# EAGLE design current_sense (EAGLE 8.7.1)
AUTHOR: Pat Pannuto; REV: v4; TITLE: Current Sense
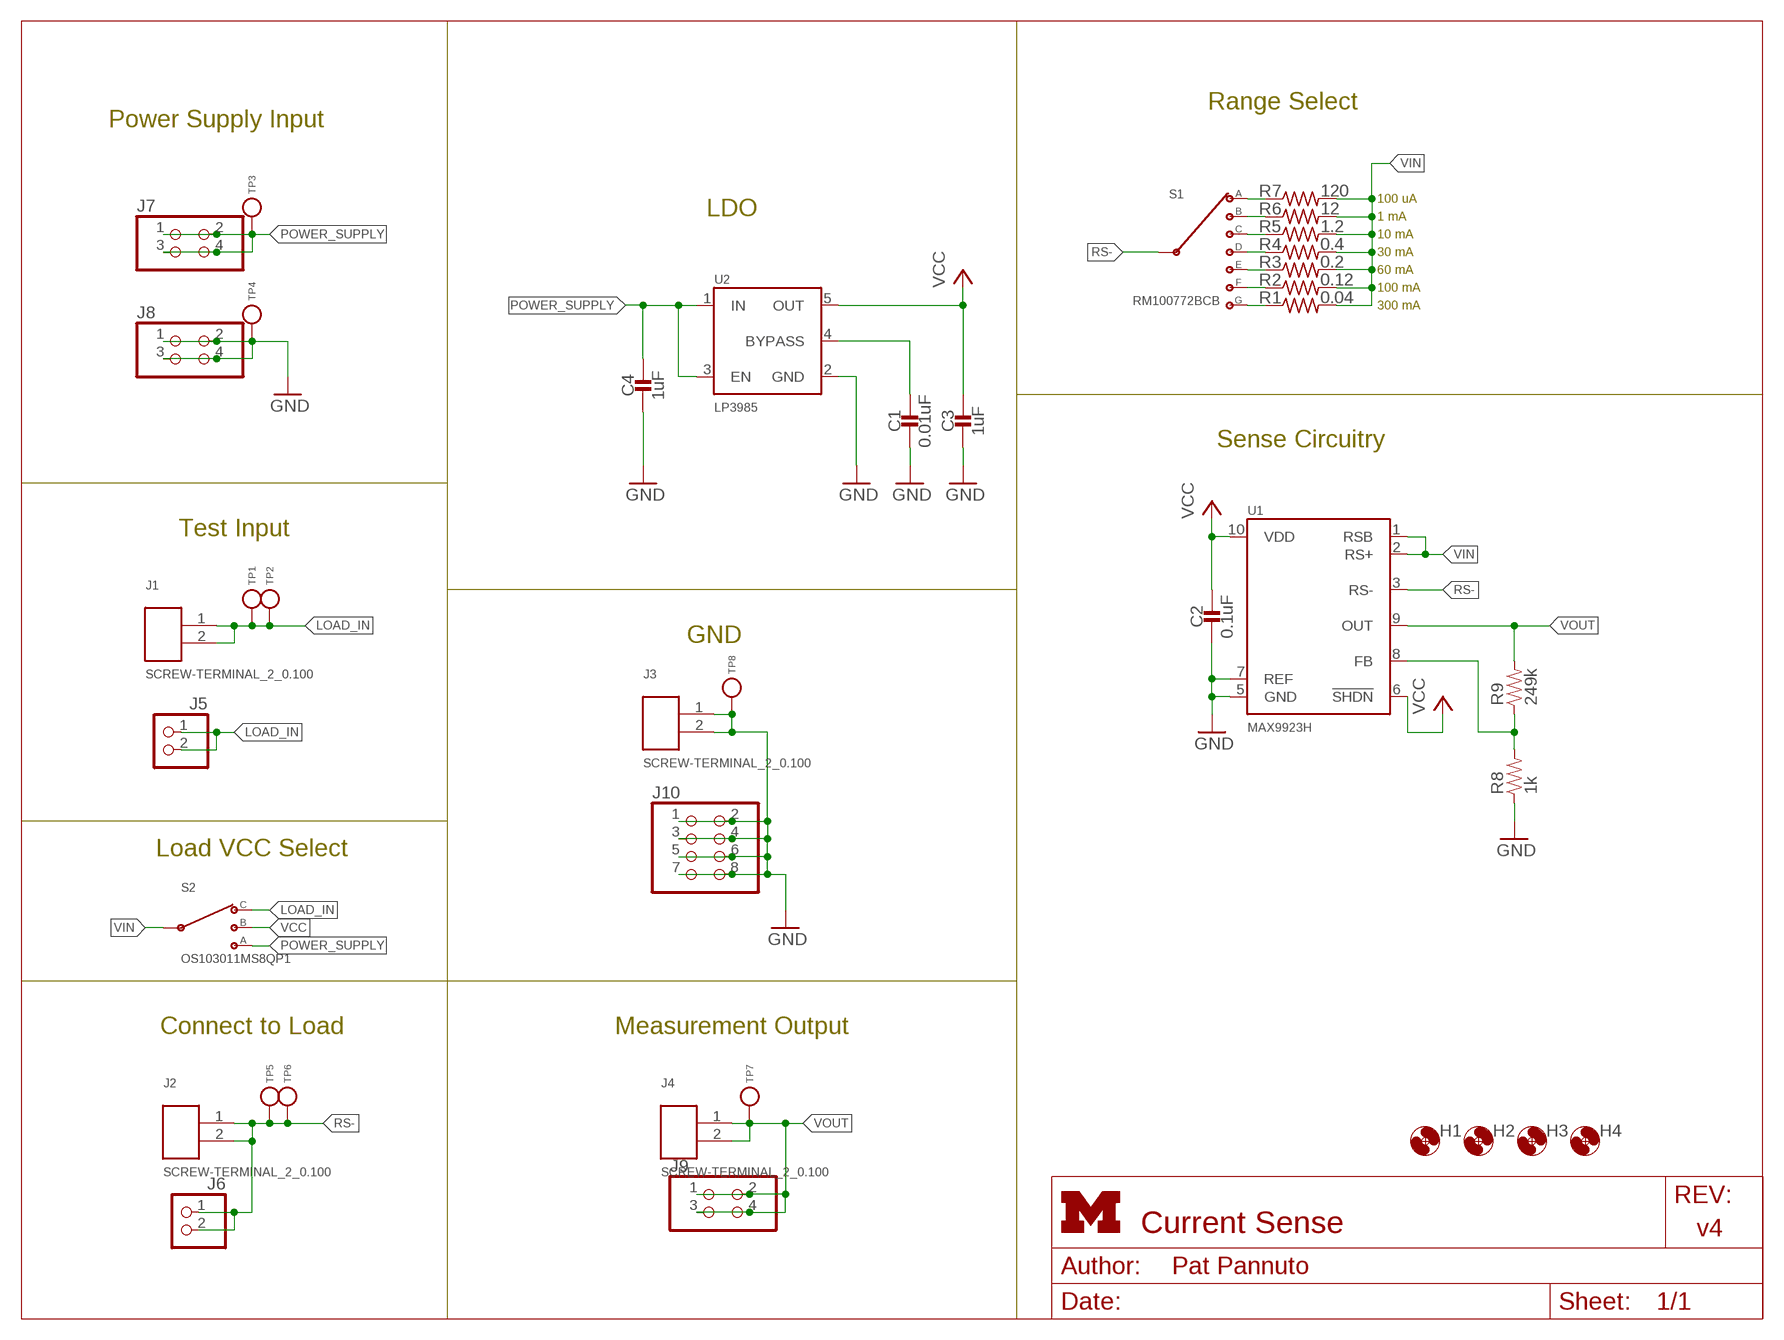
[diagram p0: schematic, sheet 1]
FRAME1 (LETTER_L_UMICH): HEIGHT: 8.5in; WIDTH: 11in

## Parts
C1  0.01uF  CAPACITOR0603_CAP  [0603_CAP]
C2  0.1uF  CAPACITOR0603_CAP  [0603_CAP]
C3  1uF  CAPACITOR0603_CAP  [0603_CAP]
C4  1uF  CAPACITOR0603_CAP  [0603_CAP]
H1  MOUNT-HOLE3.2  [3,2]
H2  MOUNT-HOLE3.2  [3,2]
H3  MOUNT-HOLE3.2  [3,2]
H4  MOUNT-HOLE3.2  [3,2]
J1  SCREW-TERMINAL_2_0.100  [CONN_BLOCK_2]
J2  SCREW-TERMINAL_2_0.100  [CONN_BLOCK_2]
J3  SCREW-TERMINAL_2_0.100  [CONN_BLOCK_2]
J4  SCREW-TERMINAL_2_0.100  [CONN_BLOCK_2]
J5  PINHD-1X2  [1X02]
J6  PINHD-1X2  [1X02]
J7  PINHD-2X2  [2X02]
J8  PINHD-2X2  [2X02]
J9  PINHD-2X2  [2X02]
J10  PINHD-2X4  [2X04]
R1  0.04  R-US_R1206  [R1206]
R2  0.12  R-US_R1206  [R1206]
R3  0.2  R-US_R1206  [R1206]
R4  0.4  R-US_R1206  [R1206]
R5  1.2  R-US_R0805  [R0805]
R6  12  R-US_R0805  [R0805]
R7  120  R-US_R0805  [R0805]
R8  1k  RESISTOR0603_RES  [0603-RES]
R9  249k  RESISTOR0603_RES  [0603-RES]
S1  RM100772BCB  [RM-SWITCH]
S2  OS103011MS8QP1  [OS102011MS8QP1]
TP1  TEST_POINT_0.040IN  [TESTPOINT_0.040IN]
TP2  TEST_POINT_0.040IN  [TESTPOINT_0.040IN]
TP3  TEST_POINT_0.040IN  [TESTPOINT_0.040IN]
TP4  TEST_POINT_0.040IN  [TESTPOINT_0.040IN]
TP5  TEST_POINT_0.040IN  [TESTPOINT_0.040IN]
TP6  TEST_POINT_0.040IN  [TESTPOINT_0.040IN]
TP7  TEST_POINT_0.040IN  [TESTPOINT_0.040IN]
TP8  TEST_POINT_0.112IN  [TESTPOINT_0.112IN]
U1  MAX9923H  [UMAX10]
U2  LP3985  [R-PDSO-G5]

## Nets
GND: C1.2 C2.2 C3.2 C4.2 J3.1 J3.2 J8.1 J8.2 J8.3 J8.4 J10.1 J10.2 J10.3 J10.4 J10.5 J10.6 J10.7 J10.8 R8.1 TP4.TESTPOINT TP8.1(TESTPOINT) U1.5(GND) U1.7(REF) U2.2(GND)
LDO_BYPASS: C1.1 U2.4(BYPASS)
LOAD_IN: J1.1 J1.2 J5.1 J5.2 S2.4 TP1.TESTPOINT TP2.TESTPOINT
POWER_SUPPLY: C4.1 J7.1 J7.2 J7.3 J7.4 S2.1 TP3.TESTPOINT U2.1(IN) U2.3(EN)
RS-: J2.1 J2.2 J6.1 J6.2 S1.C(INPUT) TP5.TESTPOINT TP6.TESTPOINT U1.3(RS-)
RS-_1MA: R6.1 S1.2(B)
RS-_10MA: R5.1 S1.3(C)
RS-_30MA: R4.1 S1.4(D)
RS-_60MA: R3.1 S1.5(E)
RS-_100MA: R2.1 S1.6(F)
RS-_100UA: R7.1 S1.1(A)
RS-_300MA: R1.1 S1.7(G)
SENSE_FB: R8.2 R9.1 U1.8(FB)
VCC: C2.1 C3.1 S2.3 U1.6(!SHDN) U1.10(VDD) U2.5(OUT)
VIN: R1.2 R2.2 R3.2 R4.2 R5.2 R6.2 R7.2 S2.2(C) U1.1(RSB) U1.2(RS+)
VOUT: J4.1 J4.2 J9.1 J9.2 J9.3 J9.4 R9.2 TP7.TESTPOINT U1.9(OUT)

## Notes on the sheet
- Range Select
- Power Supply Input
- 100 uA
- LDO | 1 mA
- 10 mA
- 30 mA
- 60 mA
- 100 mA
- 300 mA
- Sense Circuitry
- Test Input
- GND
- Load VCC Select
- Connect to Load | Measurement Output

## Library data of the parts
C1 = passives:CAPACITOR: 0402 Capacitor; DESCRIPTION: CAP CER 10000PF 25V X7R 0603; DIGIKEY: 445-5100-1-ND; MANUFACTURER: TDK; MPN: C1608X7R1E103K080AA
C2 = passives:CAPACITOR: 0402 Capacitor; DESCRIPTION: CAP CER .10UF 25V X7R 10% 0603; DIGIKEY: 445-1316-1-ND; MANUFACTURER: TDK; MPN: C1608X7R1E104K080AA
C3 C4 = passives:CAPACITOR: 0402 Capacitor; DESCRIPTION: CAP CER 1UF 16V X7R 0603; DIGIKEY: 445-1604-1-ND; MANUFACTURER: TDK; MPN: C1608X7R1C105K080AC
H1-H4 = holes:MOUNT-HOLE: MOUNTING HOLE with drill center marker
J1-J4 = headers:SCREW-TERMINAL_2_0.100: 2x 0.100 in screw terminal block; DIGIKEY: 277-1273-ND; MOUSER: 651-1725656; NEWARK: 71C4107
J5 J6 = pinhead:PINHD-1X2: PIN HEADER
J7-J9 = pinhead:PINHD-2X2: PIN HEADER
J10 = pinhead:PINHD-2X4: PIN HEADER
R1 = resistor:R-US_: RESISTOR, American symbol; DESCRIPTION: RES 0.04 OHM 1% 1/4W 1206; DIGIKEY: 311-.04LWCT-ND; MANUFACTURER: Yageo; MPN: RL1206FR-070R04L
R2 = resistor:R-US_: RESISTOR, American symbol; DESCRIPTION: RES 0.12 OHM 1% 1/2W 1206; DIGIKEY: RL16R.12FCT-ND; MANUFACTURER: Susumu; MPN: RL1632R-R120-F
R3 = resistor:R-US_: RESISTOR, American symbol; DESCRIPTION: RES 0.2 OHM 1% 1/2W 1206; DIGIKEY: CSR1206FKR200CT-ND; MANUFACTURER: Stackpole Electronics; MPN: CSR1206FKR200
R4 = resistor:R-US_: RESISTOR, American symbol; DESCRIPTION: RES 0.4 OHM 1% 1/4W 1206; DIGIKEY: 311-.4LWCT-ND; MANUFACTURER: Yageo; MPN: RL1206FR-070R4L
R5 = resistor:R-US_: RESISTOR, American symbol; DESCRIPTION: RES SMD 1.2 OHM 1% 1/3W 0805; DIGIKEY: RL12S1.2FCT-ND; MANUFACTURER: Susumu; MPN: RL1220S-1R2-F
R6 = resistor:R-US_: RESISTOR, American symbol; DESCRIPTION: RES SMD 12 OHM 0.1% 1/10W 0805; DIGIKEY: A103150CT-ND; MANUFACTURER: TE Connectivity; MPN: CPF0805B12RE1
R7 = resistor:R-US_: RESISTOR, American symbol; DESCRIPTION: RES SMD 120 OHM 0.05% 1/8W 0805; DIGIKEY: RG20N120WCT-ND; MANUFACTURER: Susumu; MPN: RG2012N-121-W-T1
R8 = passives:RESISTOR: Resistor Basic schematic elements and footprints for 0603, 1206, and PTH resistors.; DESCRIPTION: RES 1.0K OHM 1/10W .1% 0603 SMD; DIGIKEY: P1.0KDBCT-ND; MANUFACTURER: Panasonic; MPN: ERA-3AEB102V
R9 = passives:RESISTOR: Resistor Basic schematic elements and footprints for 0603, 1206, and PTH resistors.; DESCRIPTION: RES 249K OHM 1/10W .1% 0603 SMD; DIGIKEY: P249KDBCT-ND; MANUFACTURER: Panasonic; MPN: ERA-3AEB2493V
S1 = switches:RM100772BCB: Rotary Switch 8 Position SP7T 500mA (DC) 24VDC Through Hole; DESCRIPTION: SWITCH ROTARY 7POS 500MA 24V; DIGIKEY: CKN10705-ND; MANUFACTURER: C&K Components; MPN: RM107772BCB
S2 = switches:OS103011MS8QP1: Slide Switch SP3T Through Hole; DIGIKEY: CKN9543-ND
TP1-TP7 = headers:TEST_POINT_0.040IN: 0.040in Test Point; DIGIKEY: 5001K-ND
TP8 = headers:TEST_POINT_0.112IN: Solder terminal, turreted; NEWARK: 40F6015
U1 = chips:MAX992: The MAX9922/MAX9923 ultra-precision, high-side current- sense amplifiers feature ultra-low offset voltage (VOS) of 25μV (max) and laser-trimmed gain accuracy better than 0.5%. The combination of low VOS and highgain accuracy allows precise current measurements even at very small sense voltages.; DESCRIPTION: IC AMP CURRENT SENSE 10-MSOP; DIGIKEY: MAX9922EUB+TCT-ND; MANUFACTURER: Maxim Integrated; MPN: MAX9922EUB+T
U2 = chips:LP3985: Linear Voltage Regulator IC Positive Fixed 1 Output 3.3V 150mA SOT-23-5; DIGIKEY: LP3985IM5-3.3/NOPBCT-ND

## Board
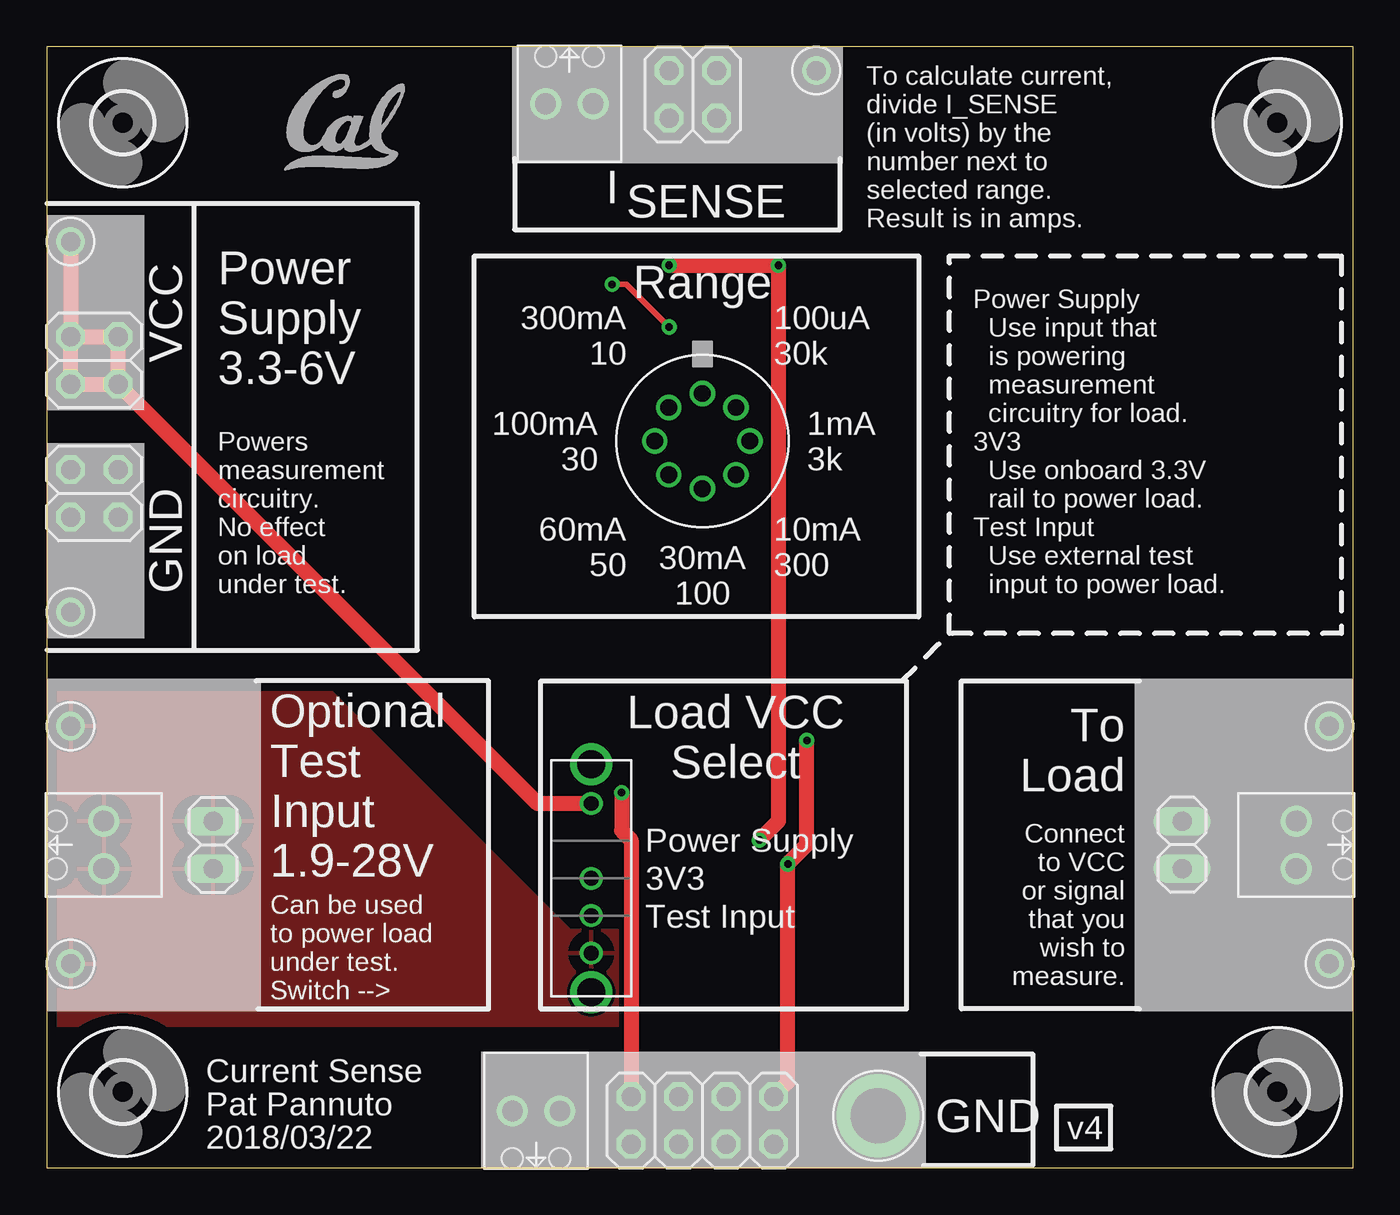
[diagram p1: board, top side]
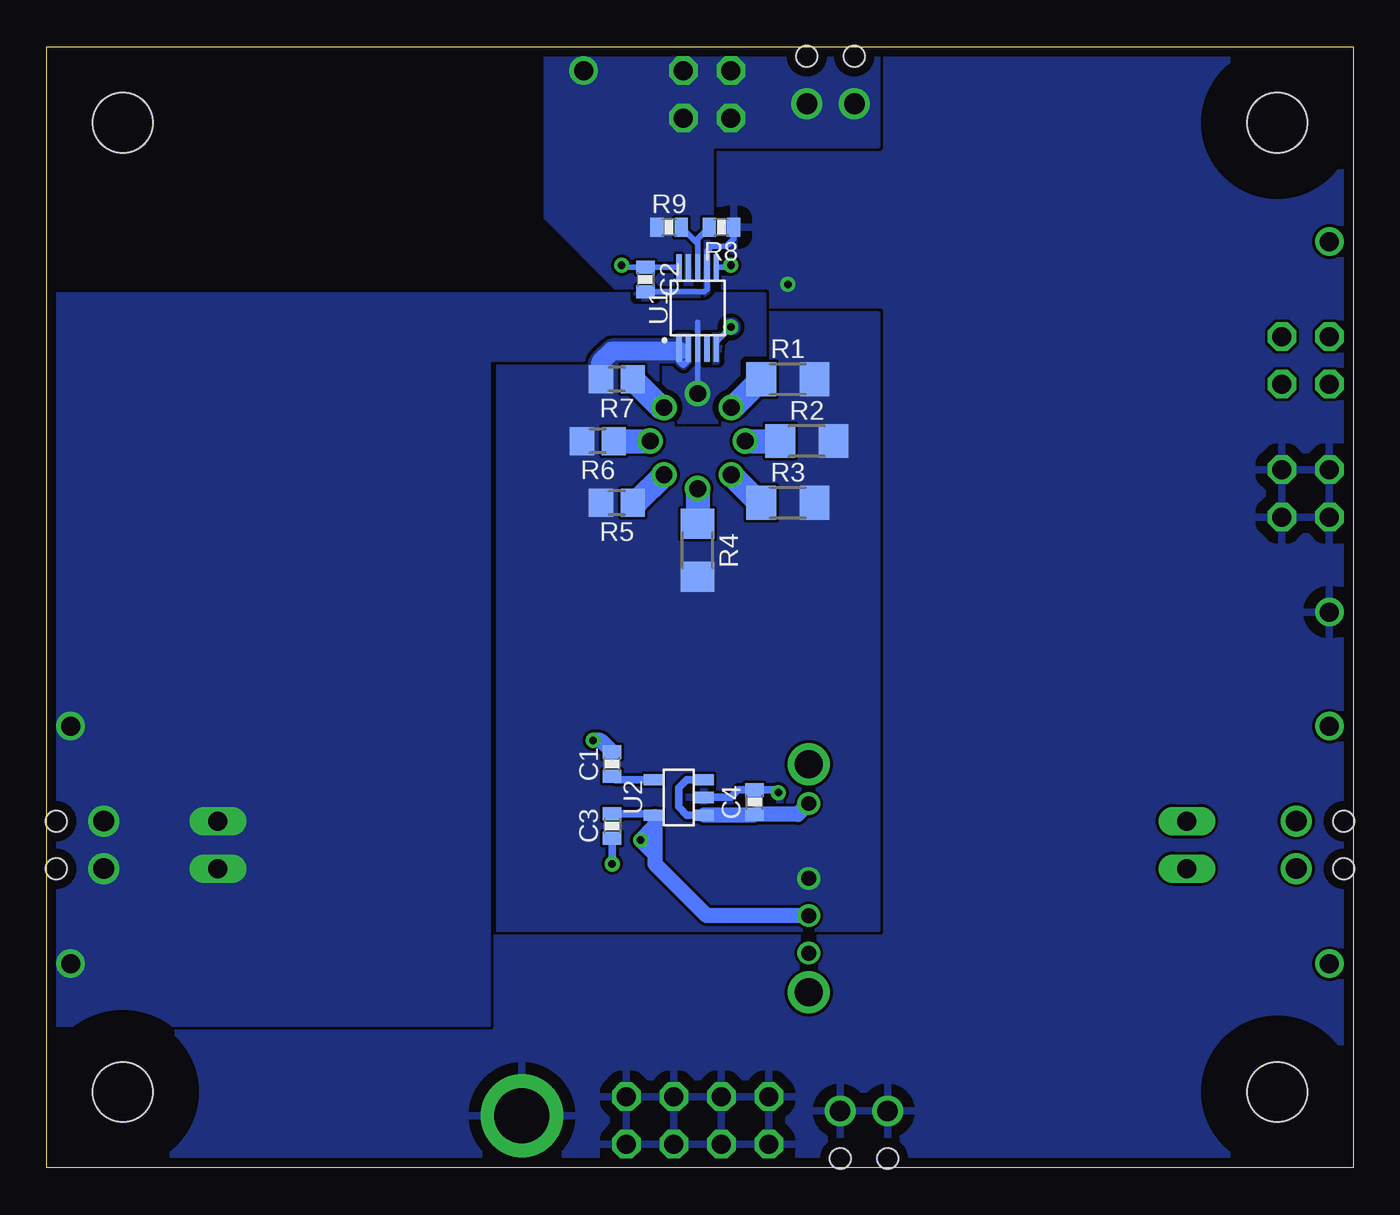
[diagram p2: board, bottom side, seen from below]

Size 69.85 x 59.94 mm. Coordinates in mm from the lower left corner, seen from the top.
Outline: 0,0 69.85,0 69.85,59.94 0,59.94 0,0
Copper layers (1*16): Top 0.0178mm / dielectric 59mil / Bottom 0.0178mm
Design rules "sunstone-2lyr_v1.0.0.3 *": minimum track width 6mil, minimum drill 14mil, track to track 6mil, track to pad 6mil, pad to pad 6mil, via to via 6mil, smd to smd 6mil, copper to edge 20mil, drill to drill 16mil, minimum pad ring 8mil, minimum via ring 8mil, stop-mask expansion 3mil, vias tented up to drill 50mil, thermal gap 25mil

### Footprints (pad centres in the part's own frame; a part is rotated, then mirrored left to right if it is on the bottom)
0603_CAP = smd 0.7 x 1: 1 -0.65,0; 2 0.65,0
3,2 = hole 3.2: 0,0
CONN_BLOCK_2 = drill 1.1: 1 -1.27,0; 2 1.27,0 | hole 1.12: -1.27,-2.54; 1.27,-2.54
1X02 = drill 1.016 long: 1 -1.27,0; 2 1.27,0
2X02 = drill 1.016 octagon: 1 -1.27,-1.27; 2 -1.27,1.27; 3 1.27,-1.27; 4 1.27,1.27
2X04 = drill 1.016 octagon: 1 -3.81,-1.27; 2 -3.81,1.27; 3 -1.27,-1.27; 4 -1.27,1.27; 5 1.27,-1.27; 6 1.27,1.27; 7 3.81,-1.27; 8 3.81,1.27
R1206 = smd 1.6 x 1.803: 1 -1.422,0; 2 1.422,0
R0805 = smd 1.3 x 1.5: 1 -0.85,0; 2 0.85,0
0603-RES = smd 0.7 x 1: 1 -0.65,0; 2 0.65,0
RM-SWITCH = drill 0.9: 1 1.796,1.796; 2 2.54,0; 3 1.796,-1.796; 4 0,-2.54; 5 -1.796,-1.796; 6 -2.54,0; 7 -1.796,1.796; C 0,2.54
OS102011MS8QP1 = drill 0.8: 1 -4,0; 2 0,0; 3 2,0; 4 4,0 | drill 1.5: MOUNT1 -6.1,0; MOUNT2 6.1,0
TESTPOINT_0.040IN = drill 1.016: TESTPOINT 0,0
TESTPOINT_0.112IN = drill 2.946: 1 0,0
UMAX10 = smd 0.28 x 1.4: 1 -1,-2.17; 2 -0.5,-2.17; 3 0,-2.17; 4 0.5,-2.17; 5 1,-2.17; 6 1,2.17; 7 0.5,2.17; 8 0,2.17; 9 -0.5,2.17; 10 -1,2.17
R-PDSO-G5 = smd 0.6 x 1.05: 1 -0.95,-1.35; 2 0,-1.35; 3 0.95,-1.35; 4 0.95,1.35; 5 -0.95,1.35

### Placement (x,y rotation side)
C1  39.62,21.59 90 bottom
C2  37.85,47.5 270 bottom
C3  39.62,18.29 270 bottom
C4  32,19.56 90 bottom
H1  4.06,4.06 0 top
H2  65.79,4.06 0 top
H3  65.79,55.88 0 top
H4  4.06,55.88 0 top
J1  3.05,17.27 270 top
J2  66.8,17.27 90 top
J3  26.16,3.05 0 top
J4  27.94,56.9 180 top
J5  8.89,17.27 90 top
J6  60.71,17.27 270 top
J7  2.54,43.18 90 top
J8  2.54,36.07 90 top
J9  34.54,57.4 0 top
J10  35.05,2.54 0 top
R1  30.23,42.16 0 bottom
R2  29.21,38.86 0 bottom
R3  30.23,35.56 0 bottom
R4  35.05,33.02 270 bottom
R5  39.37,35.56 180 bottom
R6  40.39,38.86 180 bottom
R7  39.37,42.16 180 bottom
R8  33.78,50.29 180 bottom
R9  36.58,50.29 180 bottom
S1  35.05,38.86 0 top
S2  29.11,15.49 270 top
TP1  1.27,10.92 0 top
TP2  1.27,23.62 0 top
TP3  1.27,49.53 90 top
TP4  1.27,29.72 90 top
TP5  68.58,23.62 180 top
TP6  68.58,10.92 180 top
TP7  41.15,58.67 0 top
TP8  44.45,2.79 0 top
U1  35.05,45.97 0 bottom
U2  36.07,19.81 90 bottom
U$1  [UCB_CAL_200MIL]  12.7,53.34 0 top

### Tracks (layer width: path | path; a pad name or v marks a point on that pad's centre or on a via)
GND  (via drill 0.41)
  Top 0.305: v30.23,47.24 30.99,47.24 v33.27,44.96
  Top 0.813: v30.73,20.07 30.73,18.03 31.24,17.53 J10.2 | J10.8 39.62,4.57 v39.62,16.26 40.64,17.27 v40.64,22.86
  Bottom 0.305: R8.1 33.13,49.67 33.53,49.28 34.29,49.28 34.55,49.01 U1.7 34.54,46.99 34.69,46.85 C2.2 | U1.5 34.05,44.18 v33.27,44.96
  Bottom 0.406: v30.73,20.07 30.88,20.21 C4.2 32.88,20.21 33.27,19.81 U2.2 | v39.62,16.26 C3.2
  Bottom 0.813: C1.2 40.24,22.86 v40.64,22.86
  pour Bottom (rank 6): -2.54,63.5 73.66,63.5 73.66,-2.54 -2.54,-2.54
LDO_BYPASS
  Bottom 0.406: U2.4 39.45,20.76 C1.1
LOAD_IN
  pour Top (isolate 0.127): -5.08,25.4 15.24,25.4 27.94,12.7 30.48,12.7 30.48,10.16 30.48,7.62 -5.08,7.62
POWER_SUPPLY
  Top 0.813: J7.4 J7.2 J7.1 | J7.4 J7.3 J7.1 | TP3.TESTPOINT J7.4 | S2.1 26.23,19.49 J7.1
  Bottom 0.406: C4.1 32.05,18.86 | U2.3 35.63,20.76 36.07,20.32 36.07,19.3 35.63,18.86 U2.1
  Bottom 0.813: S2.1 29.69,18.91 C4.1 | 32.05,18.86 U2.1
RS-
  Bottom 0.305: S1.C U1.3 35.05,45.21
  pour Bottom (isolate 0.305, no thermals): 31.5,46.74 31.5,39.88 36.83,39.88 36.83,43.18 46.23,43.18 46.23,7.62 71.12,7.62 71.12,46.74
RS-_1MA
  Bottom 1.27: R6.1 S1.2
RS-_10MA
  Bottom 1.27: S1.3 38.35,35.56 R5.1
RS-_30MA
  Bottom 1.27: S1.4 R4.1
RS-_60MA
  Bottom 1.27: R3.1 31.75,35.56 S1.5
RS-_100MA
  Bottom 1.27: S1.6 R2.1
RS-_100UA
  Bottom 1.27: S1.1 37.01,40.66 R7.1
RS-_300MA
  Bottom 1.27: R1.1 33.15,40.66 S1.7
SENSE_FB
  Bottom 0.305: U1.8 35.05,49.28 35.05,49.42 | 35.05,49.42 35.05,49.67 R8.2 | R9.1 35.05,49.42
VCC  (via drill 0.41)
  Top 0.813: v33.27,48.26 v39.12,48.26 39.12,18.54 v38.1,17.53
  Bottom 0.305: v33.27,48.26 33.39,48.14 U1.6 | U1.10 C2.1 39,48.15 v39.12,48.26
  Bottom 0.406: 37.34,18.78 U2.5 37.49,18.94 C3.1
  Bottom 0.813: S2.3 34.57,13.49 37.34,16.26 37.34,16.76 | 37.34,18.29 37.34,16.76 | 37.34,18.78 37.34,18.29 | 37.34,16.76 v38.1,17.53 37.34,18.29
VIN
  Bottom 0.305: U1.2 35.55,43.19 35.81,42.93 36.05,43.16 36.05,43.69 U1.1
  Bottom 1.016: 36.05,43.69 39.62,43.69 40.22,43.09 R7.2
  pour Bottom (isolate 0.127, rank 2, no thermals): 25.4,45.72 25.4,12.7 45.72,12.7 45.72,45.72
VOUT
  pour Bottom (isolate 0.127, rank 2, no thermals): 25.4,60.96 25.4,54.61 34.29,54.61 34.29,46.99 39.37,46.99 43.18,50.8 43.18,60.96

### Text on the board
tPlace: To calculate current, / divide I_SENSE / (in volts) by the / number next to / selected range. / Result is in amps. | I | SENSE | Power Supply / Use input that / is powering / measurement / circuitry for load. / 3V3 / Use onboard 3.3V / rail to power load. / Test Input / Use external test / input to power load. | VCC | Range | Power / Supply / 3.3-6V | 300mA / 10 | 100uA / 30k | Powers / measurement / circuitry. / No effect / on load / under test. | 100mA / 30 | 1mA / 3k | 60mA / 50 | 10mA / 300 | GND | 30mA / 100 | To / Load | Load VCC / Select | Optional / Test / Input / 1.9-28V | Power Supply | Connect / to VCC / or signal / that you / wish to / measure. | Can be used / to power load / under test. / Switch --> | 3V3 | Test Input | Current Sense | Pat Pannuto | GND | v4 | 2018/03/22